# Altium project LT4320同步整流.PrjPcb
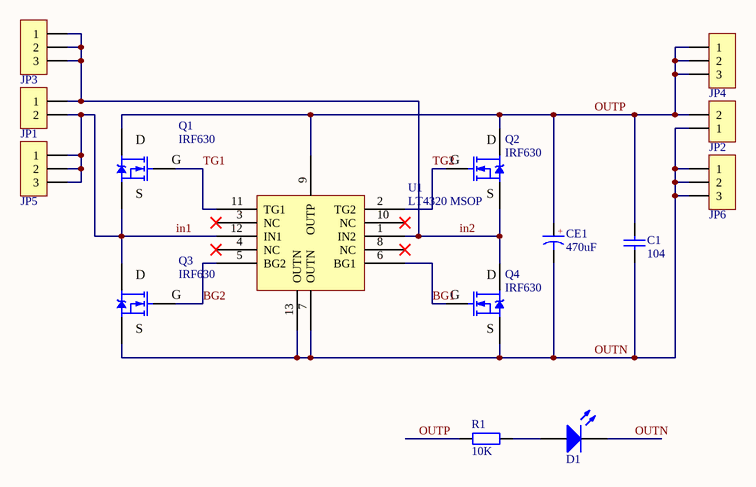
[diagram p0: LT4320同步整流.SchDoc]
1 sheet, 15 parts. Net scope: global (net labels, ports and power ports of the same name join across sheets).
Board file: TL4320同步整流.PcbDoc

## Sheet LT4320同步整流.SchDoc
size A4

### Parts
C1  104  [MLCC5.08-A]
CE1  470uF  [CAP 5.0*12.5*20 - BK]
D1  LED  [LED 3MM-R]  (value not drawn)
JP1  HDR-1X2  [KF301-5.0-2P]  (value not drawn)
JP2  HDR-1X2  [KF301-5.0-2P]  (value not drawn)
JP3  HDR-1X3  [HDR2.54-LI-3P]  (value not drawn)
JP4  HDR-1X3  [HDR2.54-LI-3P]  (value not drawn)
JP5  HDR-1X3  [HDR2.54-LI-3P]  (value not drawn)
JP6  HDR-1X3  [HDR2.54-LI-3P]  (value not drawn)
Q1  IRF630  [TO220A]
Q2  IRF630  [TO220A]
Q3  IRF630  [TO220A]
Q4  IRF630  [TO220A]
R1  10K  [RS 1/4W]
U1  LT4320 MSOP  [MSOP-12EP]

### Nets
BG1: Q4.1(G) U1.6(BG1)
BG2: Q3.1(G) U1.5(BG2)
in1: JP1.2 JP5.1 JP5.2 JP5.3 Q1.3(S) Q3.2(D) U1.12(IN1)
in2: JP1.1 JP3.1 JP3.2 JP3.3 Q2.3(S) Q4.2(D) U1.1(IN2)
OUTN: C1.1 CE1.2 D1.2(K) JP2.1 JP6.1 JP6.2 JP6.3 Q3.3(S) Q4.3(S) U1.7(OUTN) U1.13(OUTN)
OUTP: C1.2 CE1.1 JP2.2 JP4.1 JP4.2 JP4.3 Q1.2(D) Q2.2(D) R1.1 U1.9(OUTP)
TG1: Q1.1(G) U1.11(TG1)
TG2: Q2.1(G) U1.2(TG2)
NetD1_1: D1.1(A) R1.2

Not connected (* = marked no-connect by the designer): U1 3(NC)* 4(NC)* 8(NC)* 10(NC)*

### Notes on the sheet
- (in symbol CE) +

### Library data of the parts
C1 = CC: 瓷片电容; BOM名称: 直插瓷片电容; 联系卖家，免费查找封装: 唯一出售店铺网址https://shop463601444.taobao.com; 封装库来自淘宝卖家ID：黄晶宝石: 其他店铺购入均为盗版假冒封装库，请立即申请退款
CE1 = CE: 直插电解电容; 联系卖家，免费查找封装: 唯一出售店铺网址https://shop463601444.taobao.com; 封装库来自淘宝卖家ID：黄晶宝石: 其他店铺购入均为盗版假冒封装库，请立即申请退款; BOM名称: 直插电解电容
D1 = LED: 发光二极管; 封装库来自淘宝卖家 ID：黄晶宝石: 其他店铺购入均为假冒，请立即申请退款，本店奖励现金5~20元
JP1 JP2 = Header 2: 2P接插件; 封装库来自淘宝卖家 ID：黄晶宝石: 其他店铺购入均为盗版假冒封装库; 联系卖家，免费查找封装: 唯一出售店铺网址https://shop463601444.taobao.com; BOM名称: 2P接插件
JP3-JP6 = Header 3: 3P接插件; 封装库来自淘宝卖家 ID：黄晶宝石: 其他店铺购入均为盗版假冒封装库; 联系卖家，免费查找封装: 唯一出售店铺网址https://shop463601444.taobao.com; BOM名称: 3P接插件
Q1-Q4 = IRF630: N沟道 200V/9.2A; BOM名称: N沟场效应管; 联系卖家，免费查找封装: 唯一出售店铺网址https://shop463601444.taobao.com; 封装库来自淘宝卖家 ID：黄晶宝石: 其他店铺购入均为盗版，不享受售后技术支持服务，请立即申请退款
R1 = R-S: 色环电阻; 联系卖家，免费查找封装: 唯一出售店铺网址https://shop463601444.taobao.com; 封装库来自淘宝卖家ID：黄晶宝石: 其他店铺购入均为盗版假冒封装库，请立即申请退款; BOM名称: 色环电阻
U1 = LT4320 MSOP: LT4320 封装形式MSOP-12